# Altium schematic sheet MCU.SchDoc
size A; SheetNumber: 4; SheetTotal: 5
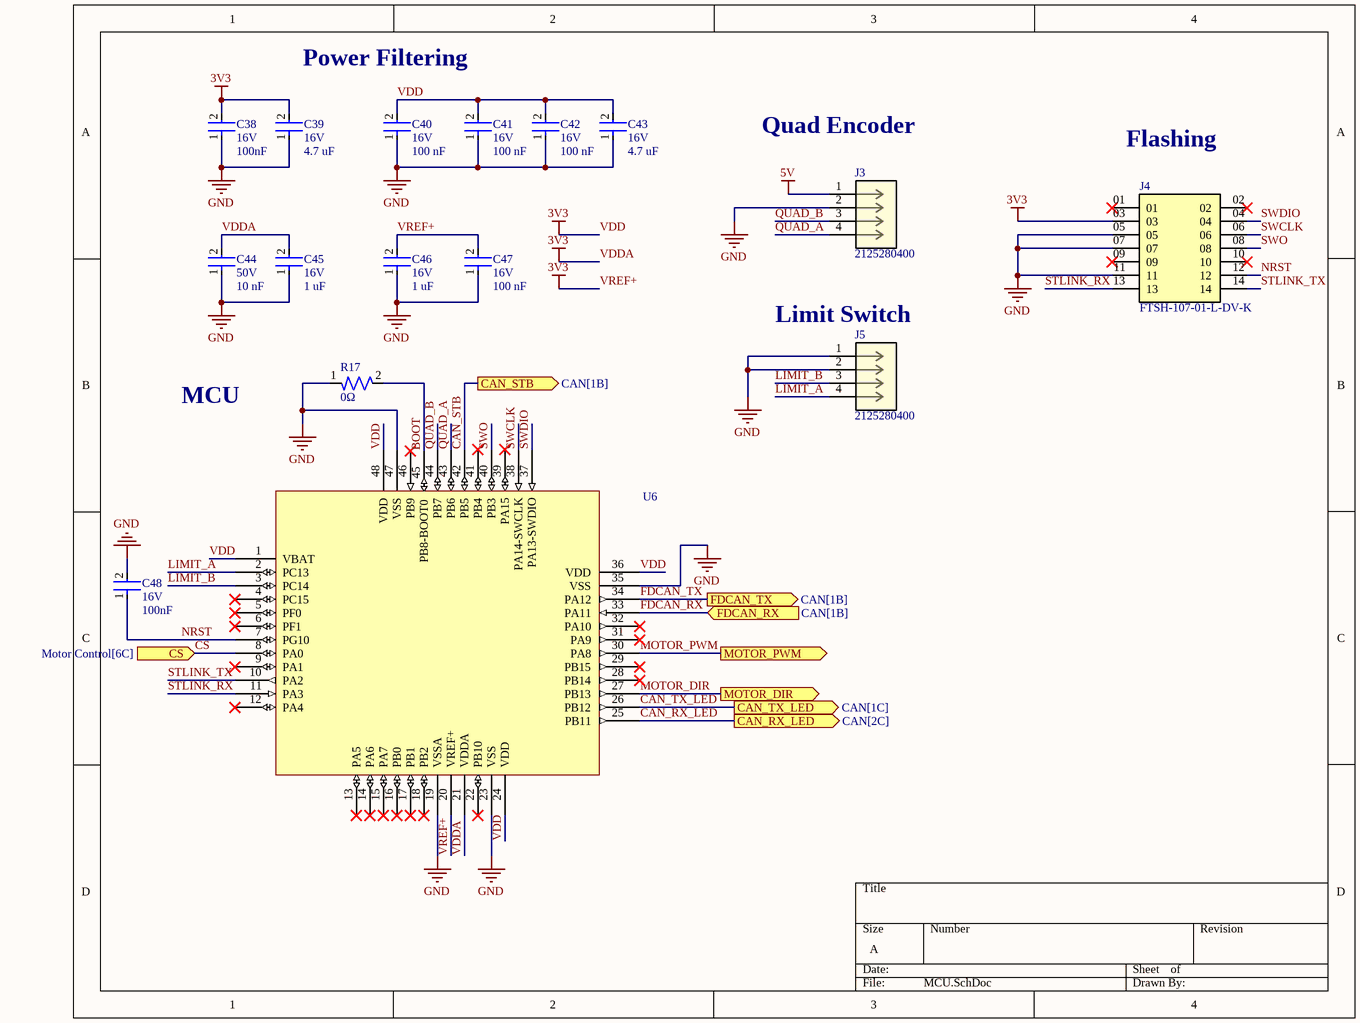
[diagram p0: MCU.SchDoc]

## Parts
C38  Voltage Rating: 16V  Capacitance: 100nF  [CAP-0805]  (hidden comment: CAP 0805)
C39  Voltage Rating: 16V  Capacitance: 4.7 uF  [CAP-0805]  (hidden comment: CAP 0805)
C40  Voltage Rating: 16V  Capacitance: 100 nF  [CAP-0805]  (hidden comment: CAP 0805)
C41  Voltage Rating: 16V  Capacitance: 100 nF  [CAP-0805]  (hidden comment: CAP 0805)
C42  Voltage Rating: 16V  Capacitance: 100 nF  [CAP-0805]  (hidden comment: CAP 0805)
C43  Voltage Rating: 16V  Capacitance: 4.7 uF  [CAP-0805]  (hidden comment: CAP 0805)
C44  Voltage Rating: 50V  Capacitance: 10 nF  [CAP-0805]  (hidden comment: CAP 0805)
C45  Voltage Rating: 16V  Capacitance: 1 uF  [CAP-0805]  (hidden comment: CAP 0805)
C46  Voltage Rating: 16V  Capacitance: 1 uF  [CAP-0805]  (hidden comment: CAP 0805)
C47  Voltage Rating: 16V  Capacitance: 100 nF  [CAP-0805]  (hidden comment: CAP 0805)
C48  Voltage Rating: 16V  Capacitance: 100nF  [CAP-0805]  (hidden comment: CAP 0805)
J3  2125280400  [CONN_2125280000_04_MOL]
J4  FTSH-107-01-L-DV-K  [SAMTEC_FTSH-107-01-L-DV-K]
J5  2125280400  [CONN_2125280000_04_MOL]
R17  Resistance: 0Ω  [RES-2010]  (hidden comment: CRF2010-J/-000ELF)
U6  STM32G431CBT6  [IC-LQFP48]  (value not drawn)

## Ports
CAN_RX_LED (out, see CAN[2C]), CAN_STB (out, see CAN[1B]), CAN_TX_LED (out, see CAN[1C]), CS (in, see Motor Control[6C]), FDCAN_RX (in, see CAN[1B]), FDCAN_TX (out, see CAN[1B]), MOTOR_DIR (out), MOTOR_PWM (out)

## Nets
5V: J3.1
GND: C38.1 C39.1 C40.1 C41.1 C42.1 C43.1 C44.1 C45.1 C46.1 C47.1 C48.2 J3.2 J4.05 J4.07 J4.11 J5.1 J5.2 R17.1 U6.19(VSSA) U6.23(VSS) U6.35(VSS) U6.47(VSS)
VDD: C38.2 C39.2 C40.2 C41.2 C42.2 C43.2 C44.2 C45.2 C46.2 C47.2 J4.03 U6.1(VBAT) U6.20(VREF+) U6.21(VDDA) U6.24(VDD) U6.36(VDD) U6.48(VDD)  [also labelled 3V3, VDDA, VREF+]
BOOT: R17.2 U6.45(PB8-BOOT0)
CAN_RX_LED: U6.25(PB11) ; port CAN_RX_LED
CAN_STB: U6.42(PB5) ; port CAN_STB
CAN_TX_LED: U6.26(PB12) ; port CAN_TX_LED
CS: U6.8(PA0) ; port CS
FDCAN_RX: U6.33(PA11) ; port FDCAN_RX
FDCAN_TX: U6.34(PA12) ; port FDCAN_TX
LIMIT_A: J5.4 U6.2(PC13)
LIMIT_B: J5.3 U6.3(PC14)
MOTOR_DIR: U6.27(PB13) ; port MOTOR_DIR
MOTOR_PWM: U6.30(PA8) ; port MOTOR_PWM
NRST: C48.1 J4.12 U6.7(PG10)
QUAD_A: J3.4 U6.43(PB6)
QUAD_B: J3.3 U6.44(PB7)
STLINK_RX: J4.13 U6.11(PA3)
STLINK_TX: J4.14 U6.10(PA2)
SWCLK: J4.06 U6.38(PA14-SWCLK)
SWDIO: J4.04 U6.37(PA13-SWDIO)
SWO: J4.08 U6.40(PB3)

Not connected (* = marked no-connect by the designer): J4 01* 02* 09* 10*; U6 4(PC15)* 5(PF0)* 6(PF1)* 9(PA1)* 12(PA4)* 13(PA5)* 14(PA6)* 15(PA7)* 16(PB0)* 17(PB1)* 18(PB2)* 22(PB10)* 28(PB14)* 29(PB15)* 31(PA9)* 32(PA10)* 39(PA15)* 41(PB4)* 46(PB9)

## Notes on the sheet
- Power Filtering
- Quad Encoder
- Flashing
- (near J5) Limit Switch
- MCU

## Library data of the parts
J3 J5 = CONN MF+ 4 PIN Right Angle Square: Micro-Fit+ Right-Angle Header, Through Hole, 3.00mm Pitch, Dual Row, 4 Circuits, 1.52Âµm Matte Tin (Sn) Plating, Glow-Wire Capable, Black; Manufacturer_Name: Molex Connector Corporation; Copyright: Copyright (C) 2026 Ultra Librarian. All rights reserved.; Manufacturer_Part_Number: 2125280400; RefDes: RefDes; Type: Type
J4 = CONN_Flashing-0001: Connector Header Surface Mount 14 position 0.050" (1.27mm); MF: Samtec; Value: *; Price: None; Package: None; Availability: Unavailable; MP: FTSH-107-01-L-DV-K; ComponentLink1Description: Datasheet; ComponentLink1URL: https://mm.digikey.com/Volume0/opasdata/d220001/medias/docus/6209/ftsh-1xx-xx-xxx-dv-xxx-xxx-x-xx-mkt.pdf
R17 = RES-0-0001: 0 Ohms Jumper Chip Resistor 2010 (5025 Metric) Automotive AEC-Q200 Metal Element; Tolerance: 1%; Size: 0402; ComponentLink1Description: Datasheet; ComponentLink1URL: https://www.yageo.com/upload/media/product/products/datasheet/rchip/PYu-RC_Group_51_RoHS_L_12.pdf
U6 = IC-STM32G431CBT6: IC MCU 32BIT 128KB FLASH 48LQFP; Package: 48LQFP; ComponentLink1Description: Datasheet; ComponentLink1URL: https://www.st.com/resource/en/datasheet/stm32g431cb.pdf